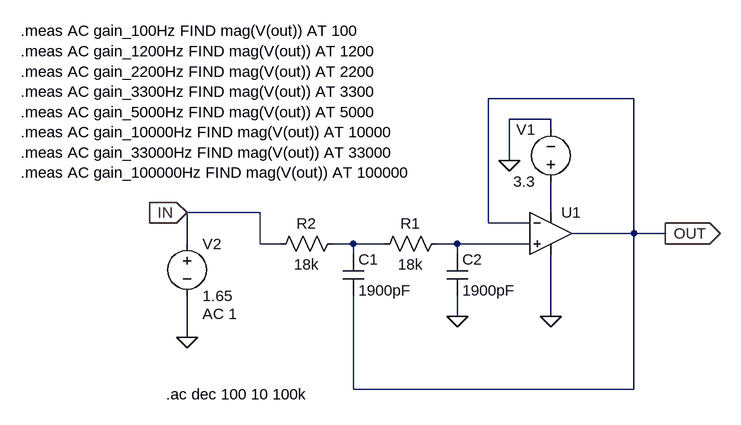
[diagram p0: schematic sallen_key_ltspice_lab.asc]
sallen_key_ltspice_lab.asc, the LTspice schematic file:
Version 4.1
SHEET 1 880 680
WIRE 400 -112 176 -112
WIRE 272 -80 208 -80
WIRE 272 -64 272 -80
WIRE 208 -16 208 -80
WIRE -176 64 -288 64
WIRE 272 64 272 16
WIRE 176 80 176 -112
WIRE 240 80 176 80
WIRE 400 96 400 -112
WIRE 400 96 304 96
WIRE 448 96 400 96
WIRE -288 112 -288 64
WIRE -176 112 -176 64
WIRE -144 112 -176 112
WIRE -32 112 -64 112
WIRE 16 112 -32 112
WIRE 128 112 96 112
WIRE 240 112 128 112
WIRE -32 128 -32 112
WIRE 128 128 128 112
WIRE 128 224 128 192
WIRE 272 224 272 128
WIRE -288 256 -288 192
WIRE -32 336 -32 192
WIRE 400 336 400 96
WIRE 400 336 -32 336
FLAG 208 -16 0
FLAG -288 256 0
FLAG -288 64 IN
IOPIN -288 64 In
FLAG 128 224 0
FLAG 272 224 0
FLAG 448 96 OUT
IOPIN 448 96 Out
SYMBOL res 112 96 R90
WINDOW 0 0 56 VBottom 2
WINDOW 3 32 56 VTop 2
SYMATTR InstName R1
SYMATTR Value 18k
SYMBOL res -48 96 R90
WINDOW 0 0 56 VBottom 2
WINDOW 3 32 56 VTop 2
SYMATTR InstName R2
SYMATTR Value 18k
SYMBOL cap 112 128 R0
SYMATTR InstName C2
SYMATTR Value 1900pF
SYMBOL voltage -288 96 R0
WINDOW 123 24 124 Left 2
WINDOW 39 0 0 Left 0
SYMATTR InstName V2
SYMATTR Value 1.65
SYMATTR Value2 AC 1
SYMBOL voltage 272 32 R180
WINDOW 0 24 96 Left 2
WINDOW 3 24 16 Left 2
WINDOW 123 0 0 Left 0
WINDOW 39 0 0 Left 0
SYMATTR InstName V1
SYMATTR Value 3.3
SYMBOL cap -48 128 R0
SYMATTR InstName C1
SYMATTR Value 1900pF
SYMBOL OpAmps\\UniversalOpAmp2 272 96 R0
SYMATTR InstName U1
TEXT -320 344 Left 2 !.ac dec 100 10 100k
TEXT -544 -216 Left 2 !.meas AC gain_100Hz FIND mag(V(out)) AT 100\n.meas AC gain_1200Hz FIND mag(V(out)) AT 1200\n.meas AC gain_2200Hz FIND mag(V(out)) AT 2200\n.meas AC gain_3300Hz FIND mag(V(out)) AT 3300\n.meas AC gain_5000Hz FIND mag(V(out)) AT 5000\n.meas AC gain_10000Hz FIND mag(V(out)) AT 10000\n.meas AC gain_33000Hz FIND mag(V(out)) AT 33000\n.meas AC gain_100000Hz FIND mag(V(out)) AT 100000

The netlist it stands for:
* sallen_key_ltspice_lab.asc
R1 N003 N002 18k
R2 N002 IN 18k
C2 N003 0 1900pF
V2 IN 0 1.65 AC 1
V1 N001 0 3.3
C1 N002 OUT 1900pF
X§U1 N003 OUT N001 0 OUT level2 Avol=1Meg GBW=10Meg Slew=10Meg Ilimit=25m Rail=0 Vos=0 En=0 Enk=0 In=0 Ink=0 Rin=500Meg  ; pins In+ In- V+ V- OUT
.ac dec 100 10 100k
.meas AC gain_100Hz FIND mag(V(out)) AT 100
.meas AC gain_1200Hz FIND mag(V(out)) AT 1200
.meas AC gain_2200Hz FIND mag(V(out)) AT 2200
.meas AC gain_3300Hz FIND mag(V(out)) AT 3300
.meas AC gain_5000Hz FIND mag(V(out)) AT 5000
.meas AC gain_10000Hz FIND mag(V(out)) AT 10000
.meas AC gain_33000Hz FIND mag(V(out)) AT 33000
.meas AC gain_100000Hz FIND mag(V(out)) AT 100000
.lib UniversalOpAmp2.lib
.backanno
.end